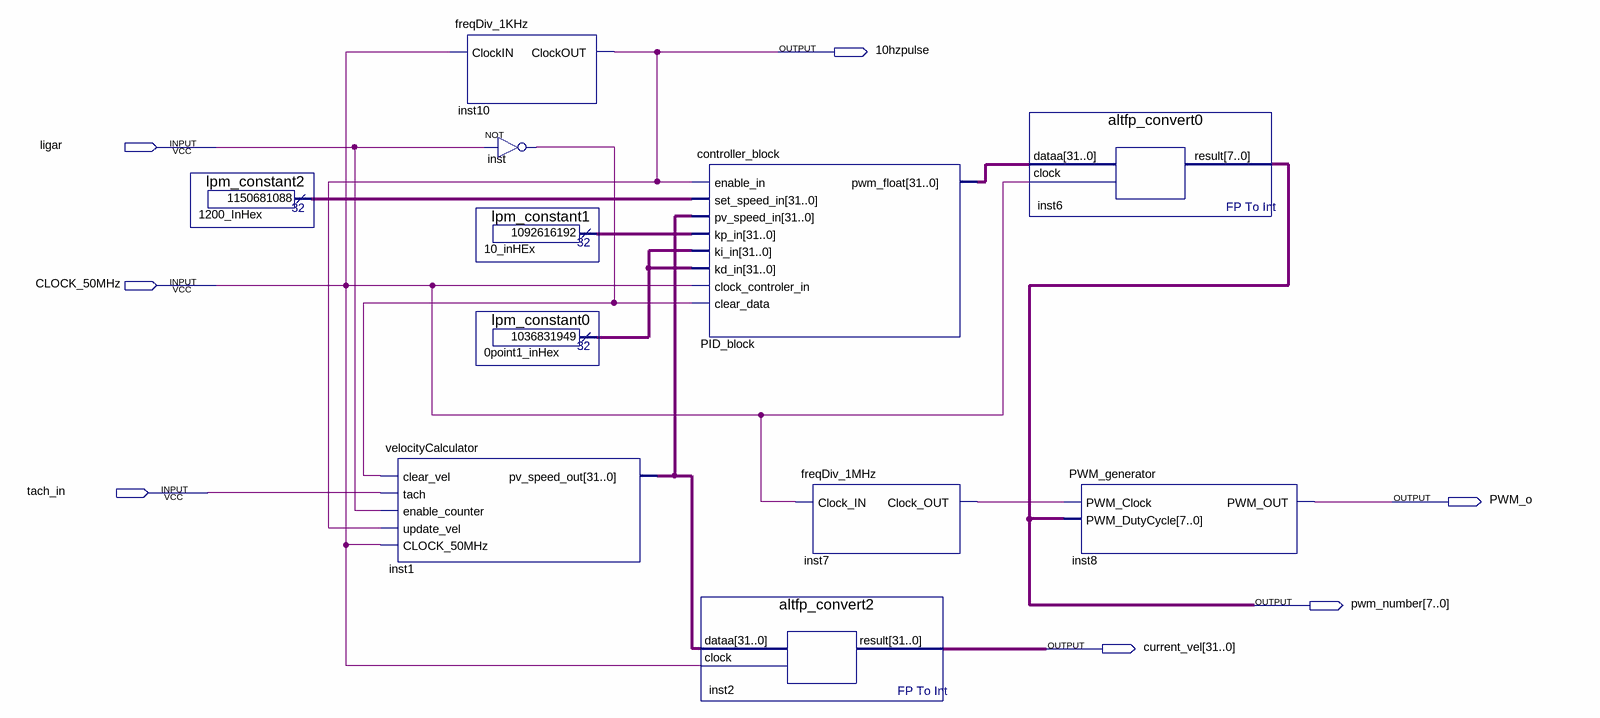
[diagram p0: schematic sheet]
// Quartus schematic PID_controller.bdf as structural Verilog: 11 symbols, 7 pins
module PID_controller (
  input  ligar,
  input  CLOCK_50MHz,
  input  tach_in,
  output \10hzpulse ,
  output PWM_o,
  output [7:0] pwm_number,
  output [31:0] current_vel
);

  wire inst7_clock_out, inst_out;
  wire [31:0] inst1_pv_speed_out, n0point1_inHex_result, n10_inHEx_result, n1200_InHex_result,
       PID_block_pwm_float;

  lpm_constant2 u_1200_InHex (.result(n1200_InHex_result));
  velocityCalculator inst1 (
    .clear_vel(inst_out), .tach(tach_in), .enable_counter(ligar), .update_vel(\10hzpulse ),
    .CLOCK_50MHz(CLOCK_50MHz), .pv_speed_out(inst1_pv_speed_out));
  freqDiv_1KHz inst10 (.ClockIN(CLOCK_50MHz), .ClockOUT(\10hzpulse ));
  lpm_constant1 u_10_inHEx (.result(n10_inHEx_result));
  lpm_constant0 u_0point1_inHex (.result(n0point1_inHex_result));
  not inst (inst_out, ligar);
  controller_block PID_block (
    .enable_in(\10hzpulse ), .set_speed_in(n1200_InHex_result), .pv_speed_in(inst1_pv_speed_out),
    .kp_in(n10_inHEx_result), .ki_in(n0point1_inHex_result), .kd_in(n0point1_inHex_result),
    .clock_controler_in(CLOCK_50MHz), .clear_data(inst_out), .pwm_float(PID_block_pwm_float));
  altfp_convert2 inst2 (.dataa(inst1_pv_speed_out), .clock(CLOCK_50MHz), .result(current_vel));
  freqDiv_1MHz inst7 (.Clock_IN(CLOCK_50MHz), .Clock_OUT(inst7_clock_out));
  altfp_convert0 inst6 (.dataa(PID_block_pwm_float), .clock(CLOCK_50MHz), .result(pwm_number));
  PWM_generator inst8 (.PWM_Clock(inst7_clock_out), .PWM_DutyCycle(pwm_number), .PWM_OUT(PWM_o));
endmodule
